# EAGLE design nucleo-block3-b-4 (EAGLE 9.6.2)
AUTHOR: Balazs Racz; DRAWING_TITLE: FREMO 3x Blockplatine; LICENSE: Licensed by the Solderpad Hardware License V2.0; REVIEWER: n/a; REVISION: A1; YEAR: 2024
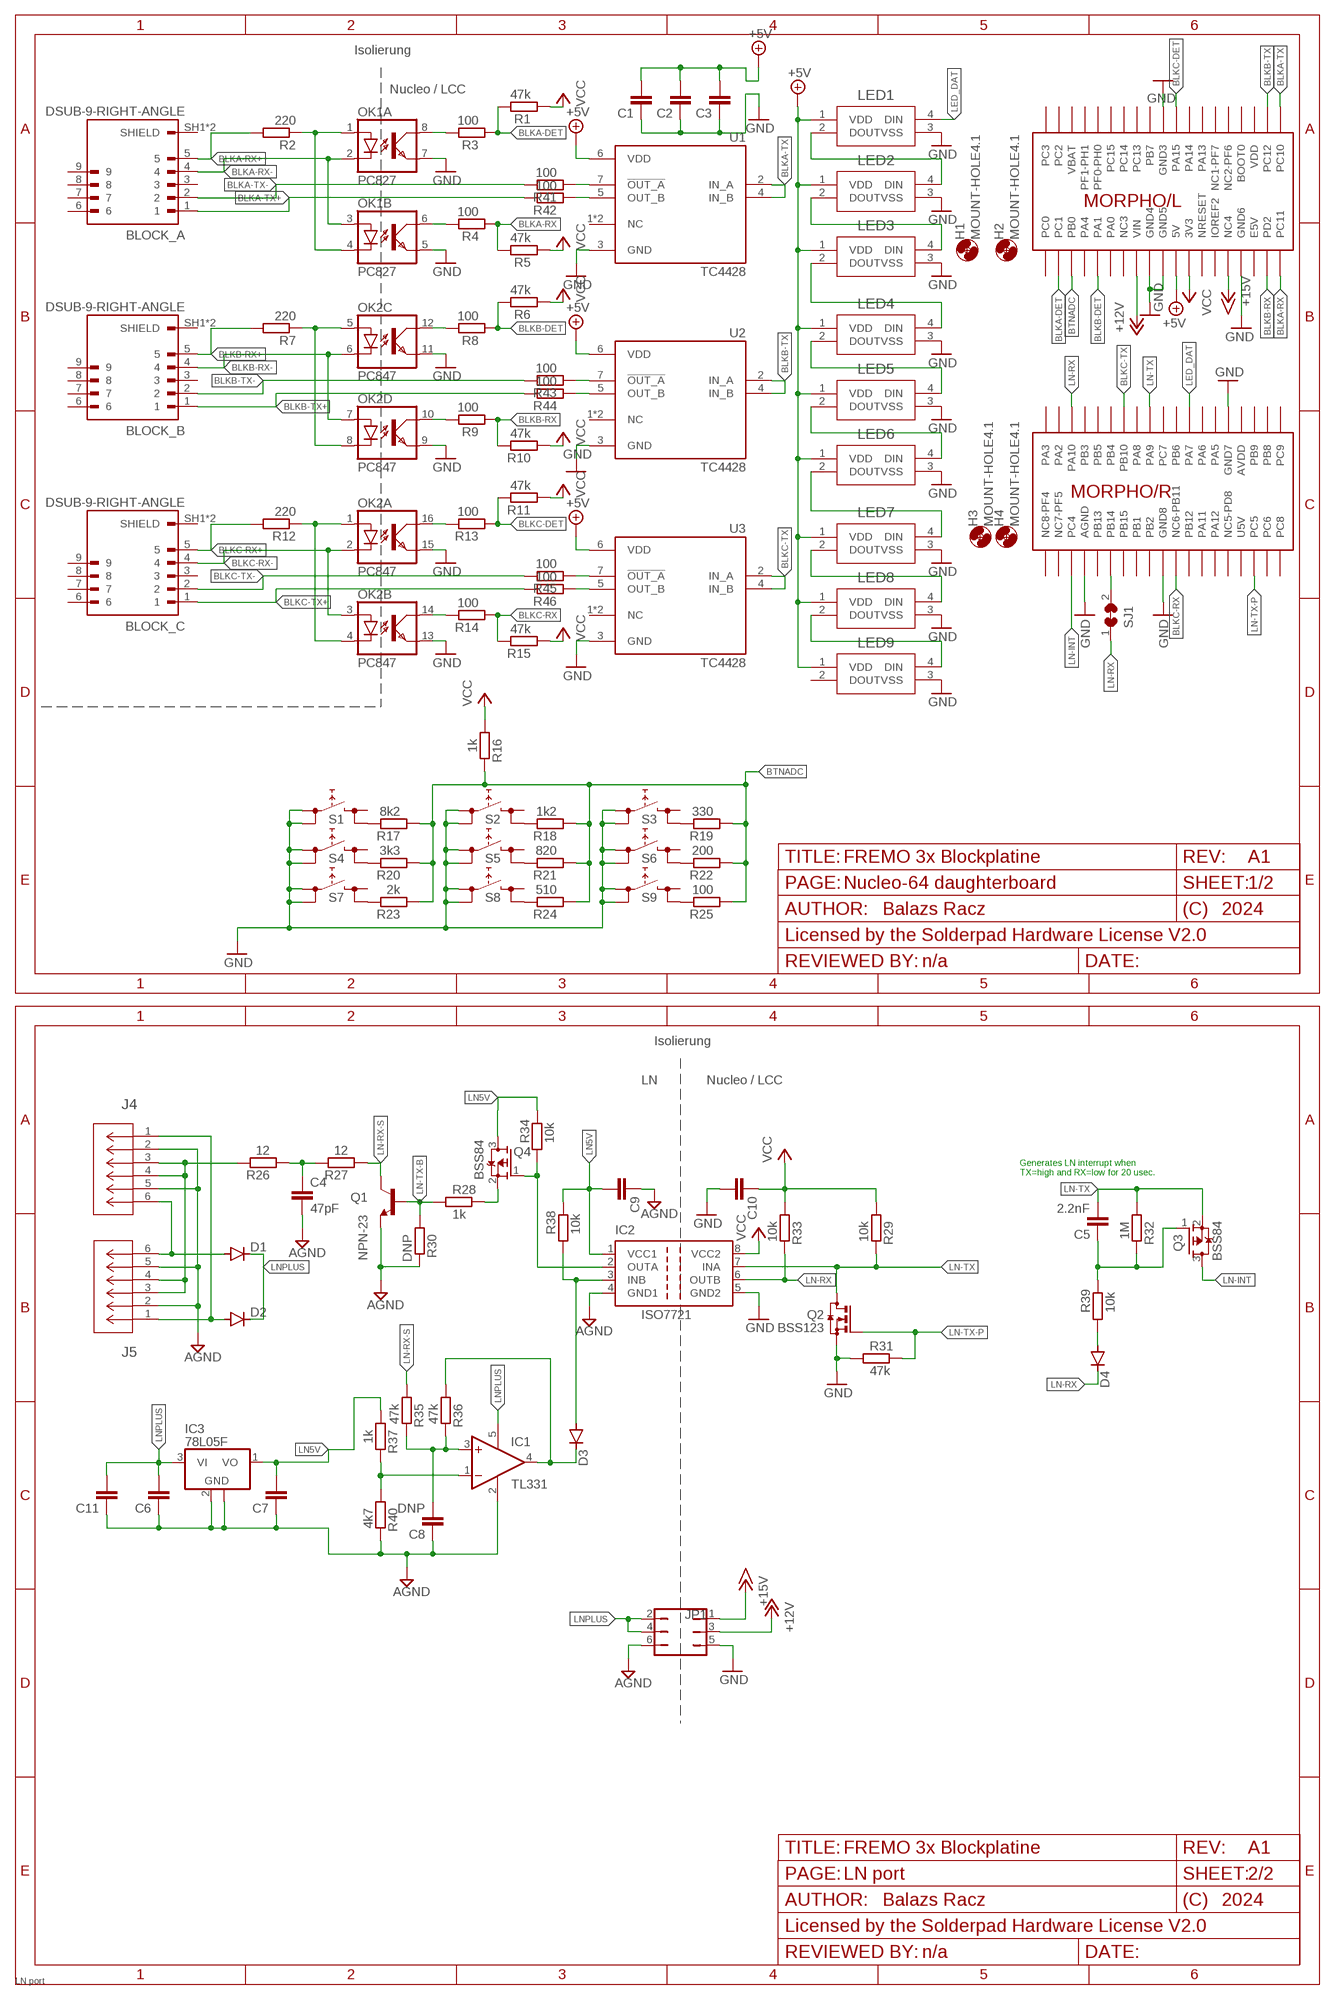
[diagram p0: schematic, sheet 1]
FRAME1 (FRAME_A_L): PAGE: Nucleo-64 daughterboard
FRAME2 (FRAME_A_L): PAGE: Input ports
FRAME3 (FRAME_A_L): PAGE: LN port

## Parts
BLOCK_A  DSUB-9-RIGHT-ANGLE  [ASSMANN_A-DS_09_A_KG-T2S]
BLOCK_B  DSUB-9-RIGHT-ANGLE  [ASSMANN_A-DS_09_A_KG-T2S]
BLOCK_C  DSUB-9-RIGHT-ANGLE  [ASSMANN_A-DS_09_A_KG-T2S]
C1  C-EUC0805  [C0805]
C2  C-EUC0805  [C0805]
C3  C-EUC0805  [C0805]
C4  47pF  C-EUC0805  [C0805]
C5  2.2nF  C-EUC0805  [C0805]
C6  C-EUC0603K  [C0603K]
C7  C-EUC0805  [C0805]
C8  DNP  C-EUC0603K  [C0603K]
C9  C-EUC0603  [C0603]
C10  C-EUC0603  [C0603]
C11  C-EUC0603K  [C0603K]
D1  DIODE-DO214AA  [DO214AA]
D2  DIODE-DO214AA  [DO214AA]
D3  DIODE-MINIMELF  [MINIMELF]
D4  DIODE-MINIMELF  [MINIMELF]
G1  NUCLEO_64_GENERIC  [NUCLEO_BRD_BASE64]
H1  MOUNT-HOLE4.1  [4,1]
H2  MOUNT-HOLE4.1  [4,1]
H3  MOUNT-HOLE4.1  [4,1]
H4  MOUNT-HOLE4.1  [4,1]
IC1  TL331  [DBV-R-PDSO-G5]
IC2  ISO7721  ISO7221A  [SO-08]
IC3  78L05F  [SOT89]
J4  MODJACK6P6C-MJ3245-66-0CONN_MJ3245-66-0_GCT  [CONN_MJ3245-66-0_GCT]
J5  MODJACK6P6C-MJ3245-66-0CONN_MJ3245-66-0_GCT  [CONN_MJ3245-66-0_GCT]
JP1  JP3Q  [JP3Q]
LED1  LED-2812BCOM-16347_SPK-M  [COM-16347_SPK-M]
LED2  LED-2812BCOM-16347_SPK-M  [COM-16347_SPK-M]
LED3  LED-2812BCOM-16347_SPK-M  [COM-16347_SPK-M]
LED4  LED-2812BCOM-16347_SPK-M  [COM-16347_SPK-M]
LED5  LED-2812BCOM-16347_SPK-M  [COM-16347_SPK-M]
LED6  LED-2812BCOM-16347_SPK-M  [COM-16347_SPK-M]
LED7  LED-2812BCOM-16347_SPK-M  [COM-16347_SPK-M]
LED8  LED-2812BCOM-16347_SPK-M  [COM-16347_SPK-M]
LED9  LED-2812BCOM-16347_SPK-M  [COM-16347_SPK-M]
OK1  PC827  [DIL08]
OK2  PC847  [DIL16]
Q1  NPN-23  [SOT23]
Q2  BSS123  [SOT23-NCH]
Q3  BSS84  [SOT23-PCH]
Q4  BSS84  [SOT23-PCH]
R1  47k  R-EU_R0805  [R0805]
R2  220  R-EU_R0805  [R0805]
R3  100  R-EU_R0805  [R0805]
R4  100  R-EU_R0805  [R0805]
R5  47k  R-EU_R0805  [R0805]
R6  47k  R-EU_R0805  [R0805]
R7  220  R-EU_R0805  [R0805]
R8  100  R-EU_R0805  [R0805]
R9  100  R-EU_R0805  [R0805]
R10  47k  R-EU_R0805  [R0805]
R11  47k  R-EU_R0805  [R0805]
R12  220  R-EU_R0805  [R0805]
R13  100  R-EU_R0805  [R0805]
R14  100  R-EU_R0805  [R0805]
R15  47k  R-EU_R0805  [R0805]
R16  1k  R-EU_R0805  [R0805]
R17  8k2  R-EU_R0603  [R0603]
R18  1k2  R-EU_R0603  [R0603]
R19  330  R-EU_R0603  [R0603]
R20  3k3  R-EU_R0603  [R0603]
R21  820  R-EU_R0603  [R0603]
R22  200  R-EU_R0603  [R0603]
R23  2k  R-EU_R0603  [R0603]
R24  510  R-EU_R0603  [R0603]
R25  100  R-EU_R0603  [R0603]
R26  12  R-EU_R0805  [R0805]
R27  12  R-EU_R0805  [R0805]
R28  1k  R-EU_R0805  [R0805]
R29  10k  R-EU_R0805  [R0805]
R30  DNP  R-EU_R0805  [R0805]
R31  47k  R-EU_R0805  [R0805]
R32  1M  R-EU_R0805  [R0805]
R33  10k  R-EU_R0805  [R0805]
R34  10k  R-EU_R0805  [R0805]
R35  47k  R-EU_R0805  [R0805]
R36  47k  R-EU_R0805  [R0805]
R37  1k  R-EU_R0805  [R0805]
R38  10k  R-EU_R0805  [R0805]
R39  10k  R-EU_R0805  [R0805]
R40  4k7  R-EU_R0805  [R0805]
R41  100  R-EU_R0805  [R0805]
R42  100  R-EU_R0805  [R0805]
R43  100  R-EU_R0805  [R0805]
R44  100  R-EU_R0805  [R0805]
R45  100  R-EU_R0805  [R0805]
R46  100  R-EU_R0805  [R0805]
S1  W1  TACTSW-6X6S  [TACTSW-6X6]
S2  W1  TACTSW-6X6S  [TACTSW-6X6]
S3  W1  TACTSW-6X6S  [TACTSW-6X6]
S4  W1  TACTSW-6X6S  [TACTSW-6X6]
S5  W1  TACTSW-6X6S  [TACTSW-6X6]
S6  W1  TACTSW-6X6S  [TACTSW-6X6]
S7  W1  TACTSW-6X6S  [TACTSW-6X6]
S8  W1  TACTSW-6X6S  [TACTSW-6X6]
S9  W1  TACTSW-6X6S  [TACTSW-6X6]
SJ1  SJ-C  [SJW-C]
U1  TC4428  TC4428ACOA  [SOIC127P600X175-8N]
U2  TC4428  TC4428ACOA  [SOIC127P600X175-8N]
U3  TC4428  TC4428ACOA  [SOIC127P600X175-8N]

## Nets
+5V: C1.2 C2.2 C3.2 G1.5V2(5V) LED1.1(VDD) LED2.1(VDD) LED3.1(VDD) LED4.1(VDD) LED5.1(VDD) LED6.1(VDD) LED7.1(VDD) LED8.1(VDD) LED9.1(VDD) U1.6(VDD) U2.6(VDD) U3.6(VDD)
+12V: G1.VIN2(VIN) JP1.3
+15V: G1.NC4 JP1.1
AGND: C4.2 C6.1 C7.1 C8.1 C9.1 C11.1 IC1.2(GND) IC2.4(GND1) IC3.2(GND) IC3.2@1(GND) J4.2 J4.5 J5.2 J5.5 JP1.6 Q1.2(E) R30.2 R40.2
BLKA-DET: G1.PC1 R1.2 R3.1
BLKA-RX: G1.PC11 R4.1 R5.2
BLKA-RX+: BLOCK_A.5 R2.2
BLKA-RX-: BLOCK_A.4 OK1.2(A:C) OK1.3(B:A)
BLKA-TX: G1.PC10 U1.2(IN_A) U1.4(IN_B)
BLKA-TX+: BLOCK_A.1 R42.2
BLKA-TX-: BLOCK_A.2 R41.2
BLKB-DET: G1.PA1 R6.2 R8.1
BLKB-RX: G1.PD2 R9.1 R10.2
BLKB-RX+: BLOCK_B.5 R7.2
BLKB-RX-: BLOCK_B.4 OK2.6(C:C) OK2.7(D:A)
BLKB-TX: G1.PC12 U2.2(IN_A) U2.4(IN_B)
BLKB-TX+: BLOCK_B.1 R44.2
BLKB-TX-: BLOCK_B.2 R43.2
BLKC-DET: G1.PA15 R11.2 R13.1
BLKC-RX: G1.NC6-PB11 R14.1 R15.2
BLKC-RX+: BLOCK_C.5 R12.2
BLKC-RX-: BLOCK_C.4 OK2.2(A:C) OK2.3(B:A)
BLKC-TX: G1.PB10 U3.2(IN_A) U3.4(IN_B)
BLKC-TX+: BLOCK_C.1 R46.2
BLKC-TX-: BLOCK_C.2 R45.2
BTNADC: G1.PB0 R16.2 R17.1 R18.1 R19.1 R20.1 R21.1 R22.1 R23.1 R24.1 R25.1
GND: C1.1 C2.1 C3.1 C10.2 G1.AGND G1.GND3 G1.GND4 G1.GND5 G1.GND6 G1.GND7 G1.GND8 IC2.5(GND2) JP1.5 LED1.3(VSS) LED2.3(VSS) LED3.3(VSS) LED4.3(VSS) LED5.3(VSS) LED6.3(VSS) LED7.3(VSS) LED8.3(VSS) LED9.3(VSS) OK1.5(B:EMIT) OK1.7(A:EMIT) OK2.9(D:EMIT) OK2.11(C:EMIT) OK2.13(B:EMIT) OK2.15(A:EMIT) Q2.2(S) R31.1 S1.1(1.1) S1.2(1.2) S2.1(1.1) S2.2(1.2) S3.1(1.1) S3.2(1.2) S4.1(1.1) S4.2(1.2) S5.1(1.1) S5.2(1.2) S6.1(1.1) S6.2(1.2) S7.1(1.1) S7.2(1.2) S8.1(1.1) S8.2(1.2) S9.1(1.1) S9.2(1.2) U1.3(GND) U2.3(GND) U3.3(GND)
LED_DAT: G1.PA7 LED1.4(DIN)
LN5V: C7.2 C9.2 IC2.1(VCC1) IC3.1(VO) Q4.3(D) R34.2 R37.1 R38.2
LN-INT: G1.PC4 Q3.3(D)
LN-RX: D4.C G1.PA10 IC2.6(OUTB) R33.2 SJ1.1
LN-RX-ALT: G1.PB14 SJ1.2
LN-RX-S: Q1.3(C) R27.1 R35.1
LN-TX: C5.2 G1.PA9 IC2.7(INA) Q2.3(D) Q3.2(S) R29.2 R32.1
LN-TX-B: Q1.1(B) R28.1 R30.1
LN-TX-P: G1.PC5 Q2.1(G) R31.2
LNPLUS: C6.2 C11.2 D1.C D2.C IC1.5(V+) IC3.3(VI) JP1.2 JP1.4
N$1: OK2.1(A:A) OK2.4(B:C) R12.1
N$2: OK2.16(A:COL) R13.2
N$3: OK2.14(B:COL) R14.2
N$4: D1.A J4.6 J5.6
N$5: C4.1 R26.1 R27.2
N$6: D2.A J4.1 J5.1
N$7: J4.3 J4.4 J5.3 J5.4 R26.2
N$8: IC2.2(OUTA) Q4.1(G) R34.1
N$9: R17.2 S1.4(2.2)
N$10: D4.A R39.1
N$11: Q4.2(S) R28.2
N$12: LED1.2(DOUT) LED2.4(DIN)
N$13: LED2.2(DOUT) LED3.4(DIN)
N$14: LED3.2(DOUT) LED4.4(DIN)
N$15: LED4.2(DOUT) LED5.4(DIN)
N$16: LED5.2(DOUT) LED6.4(DIN)
N$17: LED6.2(DOUT) LED7.4(DIN)
N$18: LED7.2(DOUT) LED8.4(DIN)
N$19: LED8.2(DOUT) LED9.4(DIN)
N$20: D3.A IC2.3(INB) R38.1
N$21: R20.2 S4.4(2.2)
N$22: C5.1 Q3.1(G) R32.2 R39.2
N$23: R23.2 S7.4(2.2)
N$24: R41.1 U1.7(!OUT_A)
N$25: R42.1 U1.5(OUT_B)
N$26: R18.2 S2.4(2.2)
N$27: R21.2 S5.4(2.2)
N$28: R24.2 S8.4(2.2)
N$29: IC1.1(-IN) R37.2 R40.1
N$30: C8.2 IC1.3(+IN) R35.2 R36.2
N$31: OK1.1(A:A) OK1.4(B:C) R2.1
N$32: R19.2 S3.4(2.2)
N$33: R22.2 S6.4(2.2)
N$34: R25.2 S9.4(2.2)
N$35: OK2.5(C:A) OK2.8(D:C) R7.1
N$36: D3.C IC1.4(OUT) R36.1
N$37: R43.1 U2.7(!OUT_A)
N$38: R44.1 U2.5(OUT_B)
N$39: R45.1 U3.7(!OUT_A)
N$40: R46.1 U3.5(OUT_B)
N$41: OK1.8(A:COL) R3.2
N$42: OK1.6(B:COL) R4.2
N$43: OK2.12(C:COL) R8.2
N$44: OK2.10(D:COL) R9.2
VCC: C10.1 G1.3V3 IC2.8(VCC2) R1.1 R5.1 R6.1 R10.1 R11.1 R15.1 R16.1 R29.1 R33.1
Unconnected: BLOCK_A.3 BLOCK_A.6 BLOCK_A.7 BLOCK_A.8 BLOCK_A.9 BLOCK_A.SH1(SHIELD) BLOCK_A.SH2(SHIELD) BLOCK_B.3 BLOCK_B.6 BLOCK_B.7 BLOCK_B.8 BLOCK_B.9 BLOCK_B.SH1(SHIELD) BLOCK_B.SH2(SHIELD) BLOCK_C.3 BLOCK_C.6 BLOCK_C.7 BLOCK_C.8 BLOCK_C.9 BLOCK_C.SH1(SHIELD) BLOCK_C.SH2(SHIELD) G1.BOOT0 G1.IOREF2 G1.NC1-PF7 G1.NC2-PF6 G1.NC3 G1.NC5-PD8 G1.NC7-PF5 G1.NC8-PF4 G1.NRESET G1.PA0 G1.PA2 G1.PA3 G1.PA4 G1.PA5 G1.PA6 G1.PA8 G1.PA11 G1.PA12 G1.PA13 G1.PA14 G1.PB1 G1.PB2 G1.PB3 G1.PB4 G1.PB5 G1.PB6 G1.PB7 G1.PB8 G1.PB9 G1.PB12 G1.PB13 G1.PB15 G1.PC0 G1.PC2 G1.PC3 G1.PC6 G1.PC7 G1.PC8 G1.PC9 G1.PC13 G1.PC14 G1.PC15 G1.PF0-PH0 G1.PF1-PH1 LED9.2(DOUT) S1.3(2.1) S2.3(2.1) S3.3(2.1) S4.3(2.1) S5.3(2.1) S6.3(2.1) S7.3(2.1) S8.3(2.1) S9.3(2.1) U1.1(NC) U1.8(NC) U2.1(NC) U2.8(NC) U3.1(NC) U3.8(NC)

## Notes on the sheet
- Isolierung
- Nucleo / LCC
- Isolierung
- LN | Nucleo / LCC
- Generates LN interrupt when
  TX=high and RX=low for 20 usec.

## Power pins joined to a net without a drawn wire
AVDD: G1.AVDD
E5V: G1.E5V
U5V: G1.U5V
VBAT: G1.VBAT
VDD: G1.VDD

## Library data of the parts
BLOCK_A BLOCK_B BLOCK_C = eagleparts:DSUB-9-RIGHT-ANGLE: A-DS_09_A_KG-T2S Female: digikey AE10921-ND Male: digikey AE10968-ND; MANUFACTURER: Assmann WSW Components; MAXIMUM_PACKAGE_HEIGHT: 12.8mm; PARTREV: 10; STANDARD: Manufacturer recommendations
C1-C11 = rcl:C-EU: CAPACITOR, European symbol; SPICEPREFIX: C
D1-D4 = diode:DIODE-: DIODE
G1 = eagleparts:NUCLEO_64_GENERIC
H1-H4 = holes:MOUNT-HOLE: MOUNTING HOLE with drill center marker
IC1 = linear:TL331: SINGLE DIFFERENTIAL COMPARATOR Source: Data sheet <http://www.ti.com/lit/ds/symlink/tl331-q1.pdf>
IC2 = texas:ISO7221: DUAL DIGITAL ISOLATORS Source: http://focus.ti.com/lit/ds/symlink/iso7221a.pdf; MPN: ISO7221AD; OC_FARNELL: 1390651; OC_NEWARK: 48M0672
IC3 = linear:78L*: POSITOIV-VOLTAGE REGULATORS Output up to 100 mA Source: Datasheet <http://focus.ti.com/lit/ds/symlink/ua78l05.pdf>
J4 J5 = eagleparts:MODJACK6P6C-MJ3245-66-0: 6p6c modular jack digikey: 2073-MJ3245-66-0-ND; COPYRIGHT: Copyright (C) 2024 Ultra Librarian. All rights reserved.; MANUFACTURER_PART_NUMBER: MJ3245-66-0; MFR_NAME: Global Connector Technology; TYPE: Modular Connector Jacks
JP1 = jumper:JP3Q: JUMPER
LED1-LED9 = eagleparts:LED-2812B; COPYRIGHT: Copyright (C) 2024 Ultra Librarian. All rights reserved.; MANUFACTURER_PART_NUMBER: COM-16347; MFR_NAME: Sparkfun; TYPE: LED Addressable
OK1 = optocoupler:PC827: SHARP OPTO COUPLER; OC_FARNELL: unknown; OC_NEWARK: unknown
OK2 = optocoupler:PC847: SHARP OPTO COUPLER; OC_FARNELL: 9707735; OC_NEWARK: unknown
Q1 = eagleparts:NPN-23
Q2 = eagleparts:BSS123: N-CHANNEL MOS FET
Q3 Q4 = eagleparts:BSS84: P-CHANNEL MOS FET
R1-R46 = rcl:R-EU_: RESISTOR, European symbol; SPICEPREFIX: R
S1-S9 = g-e2e-training:TACTSW-6X6: 6.2 X 6.5mm TACT Switch (SMD) Source: http://www3.alps.co.jp/WebObjects/catalog.woa/PDF/E/Switch/Tact/SKHM/SKHM.PDF
SJ1 = eagleparts:SJ-C
U1-U3 = eagleparts:TC4428ACOA: Low-Side Gate Driver IC Inverting, Non-Inverting 8-SOIC; MANUFACTURER: Microchip; MAXIMUM_PACKAGE_HEIGHT: 1.75 mm; PARTREV: J; STANDARD: IPC 7351B

## Net classes
0 default: width 0.254 mm, clearance 0.254 mm

## Board
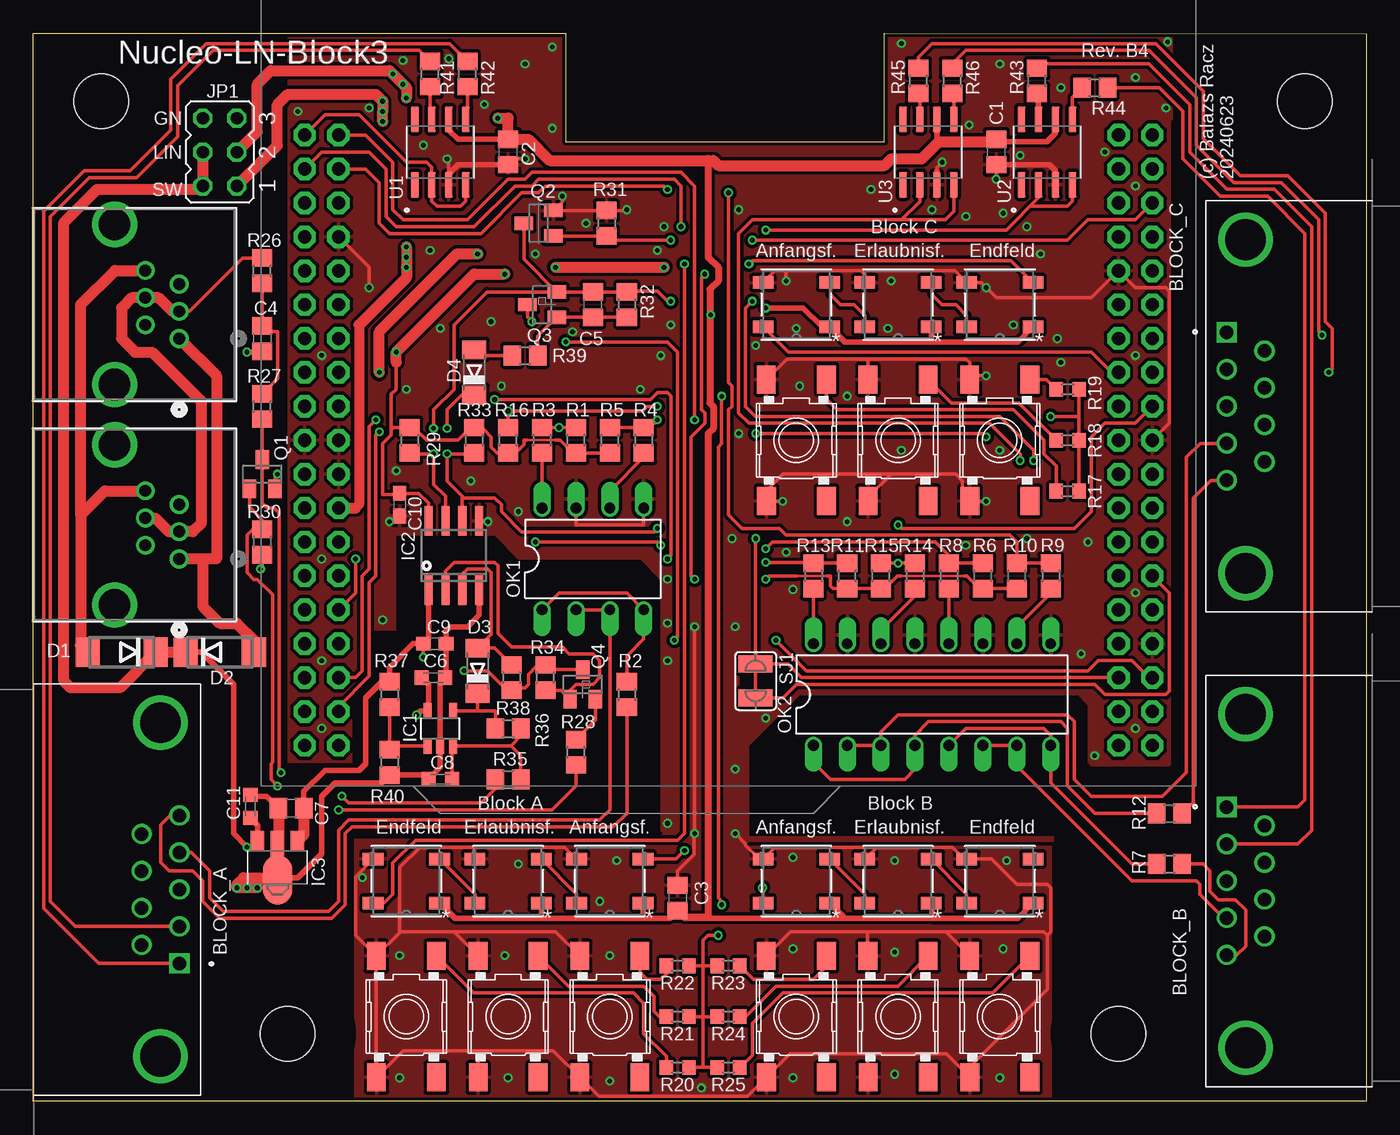
[diagram p1: board, top side]
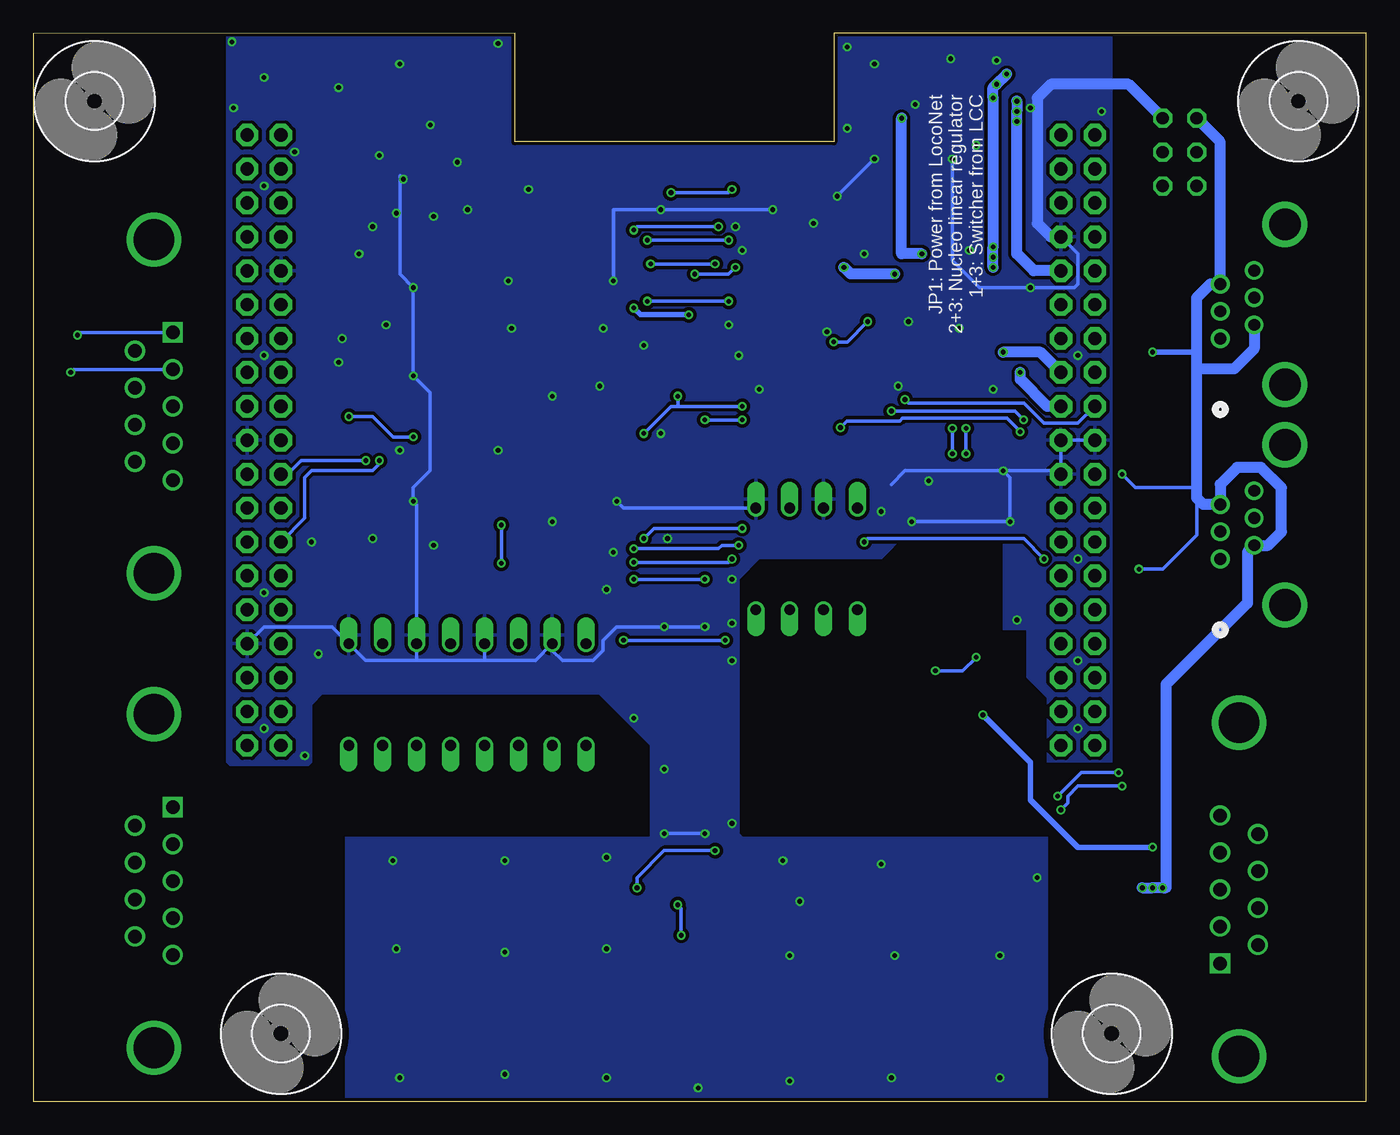
[diagram p2: board, bottom side, seen from below]

Size 99.83 x 80.01 mm. Coordinates in mm from the lower left corner, seen from the top.
Outline: 99.83,0 0,0 0,80.01 39.88,80.01 39.88,71.88 63.75,71.88 63.75,80.01 99.83,80 99.83,0
Copper layers (1*16): Top 0.035mm / dielectric 1.5mm / Bottom 0.035mm
Design rules "SeeedStudio_2layer_DRU_no_angle_20140221": minimum track width 6mil, minimum drill 12mil, track to track 6mil, track to pad 6mil, pad to pad 6mil, via to via 6mil, smd to smd 0mil, copper to edge 10mil, drill to drill 10mil, minimum pad ring 10mil, minimum via ring 6mil, stop-mask expansion 2mil, vias tented up to drill 100mil, thermal gap 10mil
tRestrict: 12 lines

### Footprints (pad centres in the part's own frame; a part is rotated, then mirrored left to right if it is on the bottom)
ASSMANN_A-DS_09_A_KG-T2S = drill 1 square: 1 5.54,1.42 | drill 1: 2 2.77,1.42; 3 0,1.42; 4 -2.77,1.42; 5 -5.54,1.42; 6 4.155,-1.42; 7 1.385,-1.42; 8 -1.385,-1.42; 9 -4.155,-1.42 | drill 3.05: SH1 -12.495,0; SH2 12.495,0
C0805 = smd 1.3 x 1.5: 1 -0.95,0; 2 0.95,0
C0603K = smd 1.05 x 1.08: 1 -0.875,0; 2 0.875,0
C0603 = smd 1.1 x 1: 1 -0.85,0; 2 0.85,0
DO214AA = smd 1.8 x 2.2: A 2.55,0; C -2.55,0
MINIMELF = smd 1.4 x 1.8: A 1.7,0; C -1.7,0
NUCLEO_BRD_BASE64 = drill 1 pad 1.676 octagon: 3V3 2.54,27.94; 5V2 2.54,25.4; AGND 63.5,7.62; AVDD 60.96,38.1; BOOT0 0,38.1; E5V 2.54,40.64; GND3 0,22.86; GND4 2.54,20.32; GND5 2.54,22.86; GND6 2.54,38.1; GND7 60.96,35.56; GND8 63.5,22.86; IOREF2 2.54,33.02; NC1-PF7 0,33.02; NC2-PF6 0,35.56; NC3 2.54,15.24; NC4 2.54,35.56; NC5-PD8 63.5,35.56; NC6-PB11 63.5,25.4; NC7-PF5 63.5,2.54; NC8-PF4 63.5,0; NRESET 2.54,30.48; PA0 2.54,12.7; PA1 2.54,10.16; PA2 60.96,2.54; PA3 60.96,0; PA4 2.54,7.62; PA5 60.96,33.02; PA6 60.96,30.48; PA7 60.96,27.94; PA8 60.96,17.78; PA9 60.96,20.32; PA10 60.96,5.08; PA11 63.5,30.48; PA12 63.5,33.02; PA13 0,30.48; PA14 0,27.94; PA15 0,25.4; PB0 2.54,5.08; PB1 63.5,17.78; PB2 63.5,20.32; PB3 60.96,7.62; PB4 60.96,12.7; PB5 60.96,10.16; PB6 60.96,25.4; PB7 0,20.32; PB8 60.96,43.18; PB9 60.96,40.64; PB10 60.96,15.24; PB12 63.5,27.94; PB13 63.5,10.16; PB14 63.5,12.7; PB15 63.5,15.24; PC0 2.54,0; PC1 2.54,2.54; PC2 0,2.54; PC3 0,0; PC4 63.5,5.08; PC5 63.5,40.64; PC6 63.5,43.18; PC7 60.96,22.86; PC8 63.5,45.72; PC9 60.96,45.72; PC10 0,45.72; PC11 2.54,45.72; PC12 0,43.18; PC13 0,17.78; PC14 0,15.24; PC15 0,12.7; PD2 2.54,43.18; PF0-PH0 0,10.16; PF1-PH1 0,7.62; U5V 63.5,38.1; VBAT 0,5.08; VDD 0,40.64; VIN2 2.54,17.78
4,1 = hole 4.1: 0,0
DBV-R-PDSO-G5 = smd 0.6 x 1.2: 1 -0.95,-1.306; 2 0,-1.306; 3 0.95,-1.306; 4 0.95,1.306; 5 -0.95,1.306
SO-08 = smd 0.6 x 2.2: 1 -1.905,-2.6; 2 -0.635,-2.6; 3 0.635,-2.6; 4 1.905,-2.6; 5 1.905,2.6; 6 0.635,2.6; 7 -0.635,2.6; 8 -1.905,2.6
SOT89 = smd 1 x 1.5: 1 -1.499,-1.981; 3 1.499,-1.981 | smd 1 x 2: 2 0,-1.727 | smd 2.2 x 3.7: 2@1 0,0.94
CONN_MJ3245-66-0_GCT = drill 0.889 pad 1.397: 1 0,0; 2 -1.02,-2.54; 3 -2.04,0; 4 -3.06,-2.54; 5 -4.08,0; 6 -5.1,-2.54 | drill 2.362 pad 2.362: 7 -8.55,-4.84; 8 3.45,-4.84
JP3Q = drill 0.914 octagon: 1 -2.54,-1.27; 2 -2.54,1.27; 3 0,-1.27; 4 0,1.27; 5 2.54,-1.27; 6 2.54,1.27
COM-16347_SPK-M = smd 1.549 x 0.94: 1 -2.489,1.65; 2 -2.489,-1.65; 3 2.489,-1.65; 4 2.489,1.65
DIL08 = drill 0.813 offset: 1 -3.81,-3.81; 2 -1.27,-3.81; 3 1.27,-3.81; 4 3.81,-3.81; 5 3.81,3.81; 6 1.27,3.81; 7 -1.27,3.81; 8 -3.81,3.81
DIL16 = drill 0.813 offset: 1 -8.89,-3.81; 2 -6.35,-3.81; 3 -3.81,-3.81; 4 -1.27,-3.81; 5 1.27,-3.81; 6 3.81,-3.81; 7 6.35,-3.81; 8 8.89,-3.81; 9 8.89,3.81; 10 6.35,3.81; 11 3.81,3.81; 12 1.27,3.81; 13 -1.27,3.81; 14 -3.81,3.81; 15 -6.35,3.81; 16 -8.89,3.81
SOT23 = smd 1 x 1.4: 1 -0.95,-1.1; 2 0.95,-1.1; 3 0,1.1
SOT23-NCH = smd 1 x 1.4: 1 -0.95,-1.1; 2 0.95,-1.1; 3 0,1.1
SOT23-PCH = smd 1 x 1.4: 1 -0.95,-1.1; 2 0.95,-1.1; 3 0,1.1
R0805 = smd 1.3 x 1.5: 1 -0.95,0; 2 0.95,0
R0603 = smd 1 x 1.1: 1 -0.85,0; 2 0.85,0
TACTSW-6X6 = smd 2.1 x 1.4: 1 -4.55,2.24; 2 4.55,2.25; 3 -4.55,-2.25; 4 4.55,-2.25
SJW-C = smd 1.27 x 2.54: 1 -1.27,0; 2 1.27,0
SOIC127P600X175-8N = smd 1.9 x 0.6: 1 -2.455,1.905; 2 -2.455,0.635; 3 -2.455,-0.635; 4 -2.455,-1.905; 5 2.455,-1.905; 6 2.455,-0.635; 7 2.455,0.635; 8 2.455,1.905

### Placement (x,y rotation side)
BLOCK_A  9.53,15.88 270 top
BLOCK_B  90.81,16.51 90 top
BLOCK_C  90.81,52.07 90 top
C1  72.12,71.12 90 top
C2  35.56,71.12 90 top
C3  48.26,15.24 270 top
C4  17.14,57.15 270 top
C5  41.91,59.69 90 top
C6  29.97,31.75 180 top
C7  19.3,21.97 0 top
C8  30.48,24.13 0 top
C9  30.06,34.29 180 top
C10  27.43,44.7 270 top
C11  16.26,22.1 270 top
D1  6.6,33.66 180 top
D2  13.97,33.66 0 top
D3  33.27,32.26 90 top
D4  33.02,54.61 90 top
G1  20.32,26.67 0 top
H1  5.08,74.93 0 bottom
H2  19.05,5.08 0 bottom
H3  81.28,5.08 0 bottom
H4  95.25,74.93 0 bottom
IC1  30.48,27.94 0 top
IC2  31.5,40.89 0 top
IC3  18.29,17.53 180 top
J4  10.92,40.64 270 top
J5  10.92,57.15 270 top
JP1  13.97,71.12 90 top
LED1  57.15,59.69 180 top
LED2  64.77,59.69 180 top
LED3  72.39,59.69 180 top
LED4  27.94,16.51 180 top
LED5  35.56,16.51 180 top
LED6  43.18,16.51 180 top
LED7  57.15,16.51 180 top
LED8  64.77,16.51 180 top
LED9  72.39,16.51 180 top
OK1  41.91,40.64 0 top
OK2  67.31,30.48 0 top
Q1  17.14,46.99 0 top
Q2  37.85,65.79 90 top
Q3  38.1,59.69 90 top
Q4  41.15,31.24 0 top
R1  40.64,49.53 90 top
R2  44.45,30.48 270 top
R3  38.1,49.53 270 top
R4  45.72,49.53 270 top
R5  43.18,49.53 90 top
R6  71.12,39.37 90 top
R7  85.09,17.78 0 top
R8  68.58,39.37 270 top
R9  76.2,39.37 270 top
R10  73.66,39.37 90 top
R11  60.96,39.37 90 top
R12  85.09,21.59 0 top
R13  58.42,39.37 270 top
R14  66.04,39.37 270 top
R15  63.5,39.37 90 top
R16  35.56,49.53 90 top
R17  77.47,45.72 180 top
R18  77.47,49.53 180 top
R19  77.47,53.34 180 top
R20  48.26,2.54 180 top
R21  48.26,6.35 180 top
R22  48.26,10.16 180 top
R23  52.07,10.16 0 top
R24  52.07,6.35 0 top
R25  52.07,2.54 0 top
R26  17.14,62.23 90 top
R27  17.14,52.07 90 top
R28  40.64,26.16 90 top
R29  28.19,49.53 270 top
R30  17.14,41.91 270 top
R31  42.93,65.79 270 top
R32  44.45,59.69 270 top
R33  33.02,49.53 270 top
R34  38.35,31.75 90 top
R35  35.56,24.13 0 top
R36  35.56,27.94 0 top
R37  26.67,30.48 270 top
R38  35.81,31.75 270 top
R39  36.83,55.88 0 top
R40  26.67,25.4 270 top
R41  29.72,76.96 90 top
R42  32.51,76.96 90 top
R43  75.18,76.45 90 top
R44  79.5,75.95 0 top
R45  66.29,76.45 90 top
R46  68.83,76.45 90 top
S1  57.15,49.53 90 top
S2  64.77,49.53 90 top
S3  72.39,49.53 90 top
S4  27.94,6.35 90 top
S5  35.56,6.35 90 top
S6  43.18,6.35 90 top
S7  57.15,6.35 90 top
S8  64.77,6.35 90 top
S9  72.39,6.35 90 top
SJ1  54.1,31.5 270 top
U1  30.48,71.12 90 top
U2  75.93,71.12 90 top
U3  67.04,71.12 90 top

### Tracks (layer width: path | path; a pad name or v marks a point on that pad's centre or on a via)
+5V  (via drill 0.35)
  Top 0.406: LED3.1 73.73,56.9 67.31,56.9 | 67.31,56.9 60.78,56.9 LED1.1 59.05,58.04 57.66,59.44 v54.86,59.44 | LED2.1 67.26,56.95 67.31,56.9 | LED4.1 31.57,13.72 38.1,13.72 | 38.1,13.72 45.72,13.72 | 45.72,13.72 47.69,13.72 C3.2 48.83,13.72 60.78,13.72 | LED6.1 45.67,13.77 45.72,13.72 | LED5.1 38.05,13.77 38.1,13.72 | LED7.1 60.78,13.72 | LED9.1 73.73,13.72 67.31,13.72 | 67.31,13.72 60.78,13.72 | LED8.1 67.31,14.81 67.31,13.72 | U2.6 76.56,72.52 75.93,71.88 72.31,71.88 | C2.2 31.82,72.07 31.11,72.77 U1.6 | v50.75,58.93 50.67,58.93 | U3.6 67.67,72.03 67.82,71.88
  Top 0.508: 50.55,70.48 50.55,63.25 51.31,62.48 51.31,61.47 50.67,60.83 50.67,58.93 50.67,52.32 50.93,52.07 50.93,50.42 50.55,50.04 50.55,13.78 48.77,13.78 C3.2
  Top 0.813: v25.91,54.61 25.91,57.66 31.75,63.5 v33.27,63.5 | v34.8,73.66 35.56,73.66 C2.2 37.08,72.07 38.67,70.48 50.55,70.48 50.93,70.48 51.31,70.1 63.75,70.1 64.26,70.61 66.55,70.61 67.82,71.88 71.93,71.88 | 71.93,71.88 72.31,71.88 C1.2 71.93,71.88
  Bottom 0.406: v54.86,59.44 54.36,58.93 v50.75,58.93
  Bottom 0.813: G1.5V2 23.88,52.07 25.91,54.1 v25.91,54.61 | v33.27,63.5 34.8,63.5 v34.8,73.66
+12V  (via drill 0.35)
  Top 0.254: v27.94,63.25 v27.94,62.48
  Top 0.762: 24.13,44.45 24.38,44.7 24.38,58.17
  Top 0.813: G1.VIN2 24.13,44.45 | JP1.3 16.76,72.64 16.76,76.2 17.78,77.22 26.67,77.22 27.94,75.95 v27.94,75.18 | 24.38,58.17 27.94,61.72 v27.94,62.48 v27.94,64.01
  Bottom 0.813: v26.92,76.96 v27.69,76.2 27.94,75.95 v27.94,75.18 v27.94,64.01 v27.94,62.48
+15V  (via drill 0.35)
  Top 0.813: JP1.1 18.26,71.6 18.26,74.65 19.05,75.44 25.65,75.44 v26.16,74.93 v26.16,74.17 v26.16,73.41
  Bottom 0.813: G1.NC4 24.89,62.23 26.16,63.5 v26.16,74.17 v26.16,74.93
AGND  (via drill 0.35)
  Top 0.254: R30.2 17.14,40.01 v17.02,39.88 | Q1.2 18.09,46.8 v18.29,46.99
  Top 0.406: C4.2 17.08,56.13 v16,56.13 | IC2.4 33.4,36.45 32.51,35.56 31.24,35.56 30.91,35.23 C9.1 30.91,31.81 C6.1 30.48,31.38 IC1.2 30.48,25 C8.1 29.29,24.45 R40.2 26.1,23.88 22.61,23.88 21.59,22.86 21.59,18.54 19.81,16.76 18.11,16.76 | IC3.2@1 IC3.2 | C11.1 16.37,22.86 17.46,22.86 C7.1
  Top 0.813: v16.76,16 v15.24,16 15.24,16.26 15.75,16.76 18.11,16.76 IC3.2@1 | C7.1 18.35,19.32 IC3.2
  Bottom 0.254: v17.02,39.88 15.24,39.88 12.7,42.42 12.7,45.21 | v18.29,46.99 17.27,45.97 12.7,45.97
  Bottom 0.406: v16,56.13 12.7,56.13
  Bottom 0.813: 12.7,54.86 12.7,45.97 12.7,45.21 12.21,44.72 J4.5 10.92,46.23 9.65,47.5 7.87,47.5 6.35,45.97 6.35,42.67 7.36,41.66 J4.2 8.89,41.15 8.89,37.34 14.99,31.24 14.99,16 v15.24,16 v16,16 v16.76,16 | 12.7,54.86 12.7,56.13 12.7,60.2 11.67,61.23 J5.5 10.92,71.88 JP1.6 | J5.2 8.38,56.39 9.91,54.86 12.7,54.86
BLKA-DET  (via drill 0.35)
  Top 0.254: R3.1 v39.37,50.48 R1.2 | G1.PC1 22.86,29.57 25.15,31.86 25.15,38.86 25.65,39.37 25.65,49.91 v25.91,50.16
  Bottom 0.254: v25.91,50.16 26.92,51.18 34.72,51.18 34.93,50.98 38.87,50.98 v39.37,50.48
BLKA-RX  (via drill 0.35)
  Top 0.254: R5.2 R4.1 46.16,50.48 v46.74,51.05 | G1.PC11 24.89,72.39 26.92,70.36 26.92,66.8 27.69,66.04 32.51,66.04 35.56,69.09 36.83,69.09 37.34,69.6 48.51,69.6 49.53,68.58 v49.53,51.05
  Bottom 0.254: v49.53,51.05 v46.74,51.05
BLKA-RX+
  Top 0.254: R2.2 44.45,21.59 43.43,20.57 23.88,20.57 23.37,20.07 23.37,14.73 22.35,13.72 15.49,13.72 13.97,13.72 12.7,14.99 12.7,16.51 12.45,16.76 12.19,17.02 11.94,17.27 10.16,17.27 9.53,17.91 9.53,20.7 10.24,21.41 BLOCK_A.5
BLKA-RX-
  Top 0.254: OK1.2 OK1.3 43.18,21.84 42.42,21.08 23.62,21.08 22.86,20.32 22.86,14.99 22.1,14.22 14.22,14.22 13.21,15.24 13.21,17.27 11.84,18.64 BLOCK_A.4
BLKA-TX
  Top 0.254: G1.PC10 21.84,73.91 24.38,73.91 27.94,70.36 29.46,70.36 29.84,69.98 U1.2 29.84,67.44 30.23,67.06 32,67.06 32.38,67.44 U1.4
BLKA-TX+
  Top 0.254: BLOCK_A.1 4.91,10.34 0.76,14.48 0.76,66.67 3.81,69.72 7.24,69.72 10.29,72.77 10.29,76.58 12.95,79.25 31.18,79.25 R42.2
BLKA-TX-
  Top 0.254: BLOCK_A.2 3.15,13.11 1.27,14.99 1.27,66.29 4.19,69.22 7.75,69.22 10.79,72.26 10.79,76.07 13.46,78.74 28.89,78.74 R41.2
BLKB-DET  (via drill 0.35)
  Top 0.254: R6.2 R8.1 68.58,40.89 67.56,41.91 55.37,41.91 v54.86,41.4 | G1.PA1 24.13,38.1 v24.13,40.64 | v37.59,41.91 46.74,41.91 v46.99,41.66
  Bottom 0.254: v24.13,40.64 25.65,42.16 37.34,42.16 v37.59,41.91 | v54.86,41.4 48.51,41.4 48.26,41.66 v46.99,41.66
BLKB-RX  (via drill 0.35)
  Top 0.254: G1.PD2 24.89,69.85 25.91,68.83 25.91,65.79 26.67,65.02 33.53,65.02 36.58,68.07 37.85,68.07 38.35,68.58 47.24,68.58 v47.5,68.33 | v52.07,68.07 52.07,53.85 52.32,53.59 52.32,52.07 52.07,51.82 52.07,43.94 53.09,42.93 55.88,42.93 56.39,42.42 73.15,42.42 73.66,41.91 R10.2 R9.1
  Bottom 0.254: v47.5,68.33 47.75,68.07 v52.07,68.07
BLKB-RX+
  Top 0.254: R7.2 87.63,17.78 88.14,17.27 88.14,15.75 88.77,15.11 90.04,15.11 90.81,14.35 90.81,11.63 90.15,10.97 BLOCK_B.5
BLKB-RX-
  Top 0.254: OK2.6 OK2.7 73.66,25.15 82.3,16.51 87.12,16.51 87.38,16.26 87.38,15.49 89.13,13.74 BLOCK_B.4
BLKB-TX  (via drill 0.35)
  Top 0.254: G1.PC12 21.59,71.12 25.15,71.12 26.42,69.85 26.42,66.29 27.18,65.53 33.02,65.53 36.07,68.58 37.34,68.58 37.85,69.09 48.01,69.09 48.51,68.58 v48.51,65.53 | v54.86,65.28 72.88,65.28 75.3,67.69 | U2.4 77.83,67.44 77.45,67.06 74.66,67.06 75.3,67.69 | 75.3,67.69 U2.2 75.3,67.69
  Bottom 0.254: v48.51,65.53 54.61,65.53 v54.86,65.28
BLKB-TX+
  Top 0.254: BLOCK_B.1 94.69,22.05 95.25,22.61 95.25,65.02 92.46,67.82 88.9,67.82 86.11,70.61 86.11,74.17 84.33,75.95 R44.2
BLKB-TX-
  Top 0.254: 75.42,77.72 83.57,77.72 86.61,74.68 86.61,71.12 89.41,68.33 92.96,68.33 95.76,65.53 95.76,20.32 94.72,19.28 BLOCK_B.2
  Top 0.406: 75.42,77.72 75.5,77.72 R43.2
BLKC-DET  (via drill 0.35)
  Top 0.254: R11.2 R13.1 58.35,40.39 v54.86,40.39 | v34.54,52.58 46.23,52.58 46.74,53.09 47.5,53.09 47.75,52.83 47.75,40.89 v47.5,40.64
  Bottom 0.254: v34.54,52.58 34.29,52.32 25.65,52.32 24.13,50.8 21.59,50.8 G1.PA15 | v47.5,40.64 47.75,40.39 v54.86,40.39
BLKC-RX  (via drill 0.35)
  Top 0.254: R15.2 v64.77,40.32 R14.1 | G1.NC6-PB11 82.55,50.8 80.26,50.8 79.25,49.78 79.25,44.2 77.98,42.93 65.02,42.93 v64.77,43.18
  Bottom 0.254: v64.77,40.32 v64.77,43.18
BLKC-RX+
  Top 0.254: R12.2 86.87,22.42 86.87,45.21 88.19,46.53 BLOCK_C.5
BLKC-RX-
  Top 0.254: OK2.2 OK2.3 63.5,27.69 64.77,28.96 77.47,28.96 77.98,28.45 77.98,24.13 79.25,22.86 84.58,22.86 86.36,24.64 86.36,48.26 87.4,49.3 BLOCK_C.4
BLKC-TX  (via drill 0.35)
  Top 0.254: v73.91,48.01 73.91,48.51 71.63,50.8 53.59,50.8 52.83,51.56 52.83,65.02 53.85,66.04 65.02,66.04 | 65.02,66.04 66.41,67.42 U3.2 | 65.02,66.04 68.31,66.04 68.94,66.67 U3.4
  Bottom 0.254: v73.91,48.01 73.91,47.75 74.42,47.24 78.99,47.24 79.5,46.74 79.5,43.69 G1.PB10
BLKC-TX+  (via drill 0.35)
  Top 0.254: v96.52,57.4 96.27,57.66 96.27,66.04 93.47,68.83 89.92,68.83 87.12,71.63 87.12,75.18 83.57,78.74 69.83,78.74 68.83,77.74 R46.2
  Bottom 0.254: BLOCK_C.1 96.31,57.61 v96.52,57.4
BLKC-TX-  (via drill 0.35)
  Top 0.254: v97.03,54.61 97.28,54.86 97.28,57.91 96.77,58.42 96.77,66.55 93.98,69.34 90.42,69.34 87.63,72.14 87.63,75.69 84.07,79.25 67.31,79.25 66.29,78.23 R45.2
  Bottom 0.254: BLOCK_C.2 96.8,54.84 v97.03,54.61
BTNADC  (via drill 0.35)
  Top 0.254: R19.1 78.32,51.31 | 78.32,51.31 R18.1 R17.1 | R20.1 50.29,2.54 | 50.29,2.54 R25.1 | 50.16,6.35 50.16,2.67 50.29,2.54 | 50.16,6.35 50.16,10.16 | 50.16,10.16 50.16,12.06 50.55,12.45 v51.31,12.45 | R21.1 50.16,6.35 | R24.1 50.16,6.35 | R22.1 50.16,10.16 | R23.1 50.16,10.16 | G1.PB0 24.13,31.75 24.64,32.26 24.64,39.37 25.15,39.88 25.15,50.55 v25.65,51.05 | v46.74,52.07 45.97,52.07 45.62,51.71 v35.56,51.71 R16.2 | v54.1,50.04 71.12,50.04 v71.37,49.78 | v76.2,51.31 78.32,51.31 | v51.56,14.73 51.56,14.99 51.31,15.24 51.31,49.02 51.56,49.28 v51.56,52.83
  Bottom 0.254: v25.65,51.05 26.31,51.71 v35.56,51.71 | v54.1,50.04 52.07,52.07 51.56,52.07 | v71.37,49.78 72.9,49.78 74.42,51.31 v76.2,51.31 | v46.74,52.07 51.56,52.07 | v51.31,12.45 51.31,14.48 v51.56,14.73 | v51.56,52.83 51.56,52.07
GND  (via drill 0.35)
  Top 0.254: LED6.3 39.8,19.05 33.02,19.05 | 27.43,12.64 S4.2 | 27.43,12.64 27.43,17.53 28.96,19.05 33.02,19.05 | S4.2 24.13,12.46 24.13,16.84 LED4.3 | S5.2 31.51,12.7 | 27.43,12.64 27.49,12.7 31.51,12.7 | S6.2 39.13,12.7 31.51,12.7 | LED5.3 33.02,18.21 33.02,19.05 | 33.27,3.81 38.93,3.81 S6.1 42.36,0.38 53.49,0.38 S7.1 56.67,3.56 62.48,3.56 | 33.27,3.81 27.69,3.81 25.7,1.82 S4.1 S4.2 | S5.1 33.32,3.76 33.27,3.81 | S7.2 56.7,12.7 62.48,12.7 | 68.34,12.7 S9.2 | 62.48,12.7 68.34,12.7 | S8.2 62.48,10.94 62.48,12.7 | 62.48,3.56 68.39,3.56 S9.1 70.15,2.59 75.95,8.38 75.95,12.45 | S8.1 62.48,1.85 62.48,3.56 | 75.95,12.45 75.69,12.7 68.34,12.7 | 75.95,12.45 76.2,12.7 76.2,16 75.95,16.26 73.66,16.26 71.76,18.16 LED9.3 69.72,18.16 68.83,19.05 63.17,19.05 | 63.17,19.05 LED8.3 | LED7.3 54.7,18.2 | 54.7,18.2 55.55,19.05 63.17,19.05 | OK1.5 45.72,43.18 40.64,43.18 OK1.7 | v71.37,44.96 70.17,44.96 S3.1 69.6,45.53 69.6,46.48 69.09,46.99 64.26,46.99 | 64.26,46.99 62.53,45.26 S2.1 | 64.26,46.99 56.13,46.99 54.91,45.77 S1.1 54.93,44.96 v56.13,44.96 | S1.2 56.45,55.63 62.48,55.63 | 70.14,54.36 70.14,55.34 69.85,55.63 62.48,55.63 | 70.14,54.36 S3.2 | S2.2 62.52,55.59 62.48,55.63 | LED1.3 55.55,62.23 56.39,62.23 | LED2.3 62.28,61.92 61.98,62.23 | 56.39,62.23 61.98,62.23 | 61.98,62.23 69.01,62.23 LED3.3 70.99,61.34 v71.37,60.96 72.14,60.2 79.25,60.2 G1.GND7 82.55,60.96 84.84,60.96 85.09,60.71 85.09,50.8 G1.GND8 | v71.37,54.36 70.14,54.36 | v72.12,69.09 C1.1 | v44.45,66.8 44.38,66.74 R31.1 Q2.2 39.62,67.41 v39.62,67.82 | v56.39,61.47 56.39,62.23 | C2.1 36,70.61 v36.83,70.61 | U1.3 31.11,70.48 v30.99,70.61 | G1.GND6 25.15,62.48 v25.15,60.96
  Top 0.254: C3.1 48.26,17.29 49.48,18.5 49.48,20.01 v49.53,20.07 v49.53,35.56 | v52.58,20.07 53.34,19.3 53.34,19.2 54.34,18.2 54.7,18.2 | 67.67,69.72 67.67,69.96 v68.07,70.36 | v26.67,43.43 27.01,43.43 C10.2 | IC2.5 33.98,43.49 v34.04,43.43
  Top 0.406: C1.1 76.12,70.17 76.56,69.72 U2.3 | U3.3 67.67,69.72 | C2.1 31.82,70.17 31.11,69.47 U1.3
  Bottom 0.254: G1.AGND 82.55,35.56 77.47,35.56 OK2.9 74.93,33.02 71.12,33.02 | 71.12,33.02 66.04,33.02 | 66.04,33.02 62.23,33.02 OK2.15 60.96,33.78 60.2,33.02 57.91,33.02 57.15,33.78 57.15,34.54 56.13,35.56 v49.53,35.56 | 71.12,33.02 OK2.11 71.12,44.7 v71.37,44.96 71.37,45.97 70.1,47.24 70.1,53.09 v71.37,54.36 v71.37,60.96 72.37,61.96 72.37,69.34 v72.12,69.09 | OK2.13 66.04,33.02 | OK1.5 55.63,44.45 v56.13,44.96 | 35.56,46.23 34.54,47.24 23.11,47.24 G1.GND4 G1.GND5 G1.GND3 | v44.45,66.8 56.39,66.8 v56.39,61.47 | v36.83,70.61 v39.62,67.82 | v30.99,70.61 30.99,62.99 28.96,60.96 v25.15,60.96 21.84,60.96 21.59,61.21 21.59,63.5 G1.GND6 | v49.53,20.07 v52.58,20.07 | v27.18,47.24 26.67,46.74 v26.67,43.43 v34.04,43.43
  Bottom 0.813: JP1.5 17.78,76.2 23.62,76.2 24.64,75.18 24.64,65.79 23.62,64.77 G1.GND6
  other vias: 47.5,35.81 47.5,39.12 47.5,33.02 47.5,20.83 43.69,18.03 42.42,14.99 36.32,17.78 35.31,10.92 43.18,10.92 27.43,10.92 24.64,16.76 27.43,1.78 35.56,1.78 43.18,1.52 50.04,1.02 56.9,1.78 64.52,2.03 72.39,1.78 72.64,11.43 64.52,11.18 56.9,11.43 56.9,18.29 64.52,18.03 72.9,18.03 52.58,24.89 54.86,28.7 52.58,35.56 56.9,38.35 52.32,42.16 56.39,41.15 69.85,41.66 74.42,42.16 78.99,41.91 78.49,33.53 82.55,38.1 79.5,25.91 82.55,27.94 72.39,48.77 65.02,48.77 60.96,43.43 52.83,50.04 57.15,57.91 54.1,56.64 57.4,53.59 60.96,52.83 64.26,61.47 64.01,57.91 73.41,58.17 76.71,57.15 76.96,55.37 82.55,55.88 75.44,63.5 74.42,65.53 72.64,66.55 69.85,66.29 67.31,66.8 73.91,70.87 80.26,71.12 82.55,68.58 84.84,74.42 76.96,75.95 82.55,76.71 70.1,73.15 65.02,79.25 72.39,77.72 84.96,79.38 38.86,72.9 33.78,74.68 31.11,78.11 29.21,71.63 38.86,78.99 36.83,77.72 47.24,65.53 37.59,63.5 41.4,65.79 46.74,63.75 34.29,58.42 27.94,53.34 30.48,57.91 46.99,55.88 47.75,58.17 45.47,53.34 35.05,53.59 62.74,68.33 52.83,66.8 36.32,44.2 26.16,36.07 32.77,46.48 21.59,33.02 21.59,27.94 21.59,40.64 21.59,55.88 19.81,74.17 25.15,74.42 27.69,77.98 29.72,63.75 40.39,57.66
  pour Bottom: 19.05,79.76 19.05,25.4 23.88,25.4 23.88,30.23 25.4,31.75 25.4,35.31 27.18,35.31 27.18,42.42 34.54,42.42 36.32,40.64 45.47,40.64 46.99,39.12 46.99,20.07 46.74,19.81 23.88,19.81 23.88,0.25 76.45,0.25 76.45,19.81 53.59,19.81 53.59,26.67 57.4,30.48 78.23,30.48 78.99,29.72 78.99,25.4 79.25,25.15 85.09,25.15 85.34,25.4 85.34,79.76 64.01,79.76 64.01,71.63 39.62,71.63 39.62,79.76
  pour Top: 19.05,79.76 19.05,25.4 23.88,25.4 23.88,30.23 25.4,31.75 25.4,35.31 27.18,35.31 27.18,42.42 34.54,42.42 36.32,40.64 45.47,40.64 46.99,39.12 46.99,20.07 46.74,19.81 23.88,19.81 23.88,0.25 76.45,0.25 76.45,19.81 53.59,19.81 53.59,26.67 57.4,30.48 78.23,30.48 78.99,29.72 78.99,25.4 79.25,25.15 85.09,25.15 85.34,25.4 85.34,79.76 64.01,79.76 64.01,71.63 39.62,71.63 39.62,79.76
LED_DAT
  Top 0.254: G1.PA7 80.77,54.61 79.25,56.13 56.57,56.13 LED1.4
LN5V  (via drill 0.35)
  Top 0.254: Q4.3 38.71,32.34 38.45,32.61 | 38.45,32.61 R34.2 | 38.45,32.61 37.69,32.61 37.08,32 37.08,31.24 36.83,30.99 36,30.99 R38.2 35.49,30.8 34.04,32.26 v32.26,32.26 | v29.21,33.27 C9.2
  Top 0.406: IC2.1 29.59,34.67 C9.2 28.45,34.29 26.67,32.51 R37.1 26.1,31.43 24.89,30.23 24.89,25.3 24.41,24.82 21.84,24.82 20.25,23.23 C7.2
  Top 0.813: C7.2 20.25,19.97 IC3.1
  Bottom 0.254: v32.26,32.26 30.23,32.26 v29.21,33.27
LN-INT  (via drill 0.35)
  Top 0.254: G1.PC4 83.57,31.75 82.3,33.02 79.76,33.02 78.99,32.26 57.91,32.26 v55.63,34.54 | v48.01,34.54 48.26,34.8 48.26,56.13 47.5,56.9 v39.88,56.9 | v37.34,58.42 37,58.76 Q3.3
  Bottom 0.254: v55.63,34.54 v48.01,34.54 | v39.88,56.9 38.86,56.9 v37.34,58.42
LN-RX  (via drill 0.35)
  Top 0.254: G1.PA10 57.55,31.75 56.53,32.77 54.61,32.77 | 54.61,32.77 SJ1.1 | 54.61,32.77 54.61,32.98 54.1,33.48 v54.1,42.16 | v46.74,42.93 46.48,42.67 36.58,42.67 35.05,44.2 35.05,44.7 34.54,45.21 32.13,45.21 | R33.2 32.95,48.51 v30.99,48.51 30.99,46.48 32.13,45.34 32.13,45.21 | v30.99,50.42 30.99,51.82 32.08,52.91 D4.C | 32.13,45.21 IC2.6
  Bottom 0.254: v46.74,42.93 53.34,42.93 v54.1,42.16 | v30.99,48.51 v30.99,50.42
LN-RX-ALT
  Top 0.254: G1.PB14 85.09,38.1 85.09,30.73 84.84,30.48 80.26,30.48 79.5,31.24 57.15,31.24 56.13,30.23 54.61,30.23 SJ1.2
LN-RX-S  (via drill 0.35)
  Top 0.254: R35.1 34.61,23.43 33.53,22.35 23.62,22.35 v23.11,22.86 | R27.1 Q1.3 17.14,44.83 17.53,44.45 18.03,44.45 18.41,44.07 18.41,24.77 v18.54,24.64
  Bottom 0.254: v18.54,24.64 21.34,24.64 v23.11,22.86
LN-TX  (via drill 0.35)
  Top 0.254: v74.93,48.01 74.93,48.77 72.39,51.31 54.1,51.31 53.34,52.07 53.34,59.44 v53.85,59.94 | v47.75,59.94 47.5,59.94 46.74,60.71 44.52,60.71 R32.1 C5.2 Q3.2 | Q3.2 36.75,63.09 Q2.3 | Q3.2 33.97,60.64 31.5,58.17 31.5,53.34 29.97,51.82 v29.97,50.42 | R29.2 28.26,48.51 v29.97,48.51 29.97,46.23 30.86,45.34 IC2.7
  Bottom 0.254: G1.PA9 80.77,46.99 79.76,48.01 v74.93,48.01 | v53.85,59.94 v47.75,59.94 | v29.97,50.42 v29.97,48.51
LN-TX-B  (via drill 0.35)
  Top 0.254: R28.1 40.64,23.62 38.86,21.84 v22.86,21.84 | Q1.1 16.2,44.51 17.14,43.56 R30.1 16.44,42.86 16,42.42 16,39.62 16.51,39.12 16.76,39.12 17.91,37.97 17.91,25.4 17.79,25.29 17.79,24.12 v18.29,23.62
  Bottom 0.254: v22.86,21.84 22.35,22.35 22.35,22.86 21.59,23.62 v18.29,23.62
LN-TX-P  (via drill 0.35)
  Top 0.254: Q2.1 R31.2 43.25,64.52 v47.75,64.52 | G1.PC5 82.55,66.04 78.99,66.04 77.47,64.52 v53.85,64.52
  Bottom 0.254: v53.85,64.52 v47.75,64.52
LNPLUS  (via drill 0.35)
  Top 0.406: C6.2 29.61,31.24 29.61,29.32 IC1.5 28.99,29.25 v28.7,28.96 | C11.2 16.79,20.69 IC3.3 16.33,19.05 v16,19.05 14.99,20.07 14.99,26.92 14.99,27.18 14.99,31.24 12.57,33.66 D2.C
  Top 0.813: D2.C D1.C 6.49,30.99 2.79,30.99 2.29,31.5 2.29,65.84 4.77,68.33 12.45,68.33 JP1.2 JP1.4
  Bottom 0.406: v16,19.05 21.59,19.05 25.15,22.61 25.15,25.4 v28.7,28.96
N$1
  Top 0.254: R12.1 79.5,21.59 77.47,23.62 77.47,27.94 76.96,28.45 67.06,28.45 66.04,27.43 OK2.4 66.04,24.89 65.28,24.13 59.69,24.13 58.42,25.4 OK2.1
N$2
  Top 0.254: OK2.16 R13.2
N$3
  Top 0.254: OK2.14 63.5,35.31 66.04,37.85 R14.2
N$4
  Top 0.813: D1.A 3.55,34.16 3.55,43.93 | J4.6 5.35,45.74 3.55,43.93 | 3.55,43.93 3.55,59.68 6.12,62.25 J5.6
N$5
  Top 0.254: R26.1 C4.1 17.59,57.66 18.29,57.66 18.29,54.16 R27.2
N$6
  Top 0.813: J5.1 13.72,54.36 13.72,40.64 12.7,40.64 | 12.7,40.64 J4.1 | 12.7,40.64 12.7,37.08 13.97,35.81 15.24,35.81 16.52,34.53 D2.A
N$7
  Top 0.254: J5.3 11.69,59.19 15.68,63.18 R26.2
  Top 0.813: J5.3 10.41,59.19 9.39,60.21 J5.4 7.38,60.21 6.6,59.44 6.6,57.15 7.62,56.13 8.89,56.13 12.57,52.45 12.57,43.31 11.95,42.68 J4.3 10.15,42.68 9.13,43.7 J4.4
N$8
  Top 0.254: R34.1 39.54,30.8 Q4.1 40.2,30.8 40.64,31.24 41.91,31.24 42.42,31.75 42.42,33.02 41.91,33.53 40.13,33.53 39.62,34.04 35.81,34.04 34.8,35.05 34.8,40.13 34.54,40.39 31.5,40.39 30.86,39.75 IC2.2
N$9
  Top 0.254: R17.2 76.62,47.59 75.69,48.51 75.69,49.53 73.41,51.82 60.2,51.82 59.4,52.61 S1.4
N$10
  Top 0.254: R39.1 33.45,55.88 D4.A
N$11
  Top 0.254: R28.2 42.1,28.57 Q4.2
N$12
  Top 0.254: LED1.2 59.69,61.29 59.69,60.45 60.45,59.69 61.47,59.69 62.28,58.88 LED2.4
N$13
  Top 0.254: LED2.2 67.31,61.29 67.31,60.45 68.07,59.69 69.09,59.69 69.9,58.88 LED3.4
N$14  (via drill 0.35)
  Top 0.254: LED3.2 73.23,62.99 53.85,62.99 v53.59,62.74 | LED4.4 26.29,14.86 26.92,15.49 26.92,17.85 28.63,19.56 48.26,19.56 48.77,20.07 v48.77,62.74
  Bottom 0.254: v53.59,62.74 v48.77,62.74
N$15
  Top 0.254: LED4.2 33.07,15.52 LED5.4
N$16
  Top 0.254: LED5.2 40.69,15.52 LED6.4
N$17  (via drill 0.35)
  Top 0.254: LED6.2 48.13,18.16 v48.77,18.8 | v54.61,16 54.66,15.95 LED7.4
  Bottom 0.254: v54.61,16 54.61,16.76 52.58,18.8 v48.77,18.8
N$18
  Top 0.254: LED7.2 62.28,15.52 LED8.4
N$19
  Top 0.254: LED8.2 69.9,15.52 LED9.4
N$20
  Top 0.254: IC2.3 32.13,39.5 32.51,39.88 34.04,39.88 34.29,39.62 34.29,34.97 D3.A 34.56,33.96 R38.1
N$21
  Top 0.254: S4.4 32.96,8.13 44.96,8.13 45.72,7.37 45.72,5.08 47.41,3.39 R20.2
N$22
  Top 0.254: R32.2 C5.1 Q3.1 37.78,57.32 R39.2
N$23
  Top 0.254: S7.4 59.4,10.12 58.42,9.14 53.94,9.14 R23.2
N$24
  Top 0.254: R41.1 29.72,73.7 U1.7
N$25
  Top 0.254: R42.1 32.51,73.7 U1.5
N$26
  Top 0.254: R18.2 73.83,52.32 68.78,52.32 S2.4
N$27
  Top 0.254: S5.4 40.07,8.64 45.72,8.64 46.48,7.87 46.48,6.77 46.9,6.35 R21.2
N$28
  Top 0.254: S8.4 64.76,8.64 55.63,8.64 53.34,6.35 R24.2
N$29
  Top 0.254: R37.2 R40.1 26.95,26.63 IC1.1
N$30
  Top 0.254: C8.2 31.36,26.56 IC1.3 35.78,26.63 | R36.2 36.51,27.37 35.78,26.63 | 35.78,26.63 36.51,25.9 R35.2
N$31
  Top 0.254: R2.1 44.45,33.36 45.72,34.63 OK1.4 44.45,38.1 39.37,38.1 OK1.1
N$32
  Top 0.254: S3.4 75.88,54.08 R19.2
N$33
  Top 0.254: S6.4 45.43,9.69 45.97,9.14 46.99,9.14 47.41,9.56 R22.2
N$34
  Top 0.254: S9.4 71.87,8.13 56.13,8.13 53.85,5.84 53.85,3.47 R25.2
N$35
  Top 0.254: R7.1 82.3,17.78 76.2,23.88 OK2.8 76.2,27.43 75.69,27.94 69.85,27.94 OK2.5
N$36
  Top 0.254: R36.1 34.61,29.21 34.57,29.25 33.27,29.25 | IC1.4 33.27,29.25 | D3.C 33.27,29.25
N$37
  Top 0.406: R43.1 75.3,75.39 U2.7
N$38
  Top 0.254: R44.1 77.83,75.23 U2.5
N$39
  Top 0.254: R45.1 66.41,75.39 U3.7
N$40
  Top 0.254: R46.1 68.94,75.39 U3.5
N$41
  Top 0.254: OK1.8 R3.2
N$42
  Top 0.254: OK1.6 43.18,45.59 43.27,45.8 45.72,48.26 R4.2
N$43
  Top 0.254: OK2.12 R8.2
N$44
  Top 0.254: OK2.10 73.66,35.56 76.2,38.1 R9.2
VCC  (via drill 0.35)
  Top 0.203: 39.12,49.53 36.98,49.53 | 69.7,39.37 64.97,39.37 | 57.15,39.37 59.44,39.37
  Top 0.254: R5.1 R1.1 40.39,48.58 39.44,49.53 39.12,49.53 | 36.98,49.53 36.76,49.53 36.76,49.21 36.13,48.58 R16.1 34.73,48.58 34.29,49.02 34.29,49.78 33.78,50.29 33.21,50.29 R33.1 32.77,50.48 31.82,49.53 29.44,49.53 28.49,50.48 R29.1 27,50.48 26.81,50.29 | R10.1 R6.1 70.87,38.42 69.92,39.37 69.7,39.37 | 64.97,39.37 64.7,39.37 63.75,38.42 R15.1 R11.1 59.88,38.42 59.69,38.61 59.69,39.37 59.44,39.37 | 27.18,55.37 27.18,53.34 26.81,52.97 26.81,50.29 | 26.81,50.29 26.81,49.92 26.16,49.28 26.16,45.47 27.34,45.47 C10.1 28.87,45.55 29.59,44.83 IC2.8 | v50.29,61.98 50.04,61.72 50.04,51.82 50.29,51.56 50.29,50.8 49.28,49.78 49.28,39.37 v49.53,39.12 | v54.86,39.12 55.12,39.37 57.15,39.37
  Top 0.813: 27.18,55.37 v27.18,56.13 33.02,61.98 v35.31,61.98 | v39.12,62.48 v47.24,62.48
  Bottom 0.254: v47.24,62.48 47.75,61.98 v50.29,61.98 | v49.53,39.12 v54.86,39.12
  Bottom 0.813: G1.3V3 24.38,56.13 v27.18,56.13 | v35.31,61.98 38.61,61.98 v39.12,62.48

### Text on the board
tPlace: Block C | Anfangsf. | Erlaubnisf. | Endfeld | Block A | Block B | Endfeld | Erlaubnisf. | Anfangsf. | Anfangsf. | Erlaubnisf. | Endfeld
tNames: Nucleo-LN-Block3 | Rev. B4 | GN | LIN | SW | (c) Balazs Racz / 20240623
bNames: JP1: Power from LocoNet / 2+3: Nucleo linear regulator / 1+3: Switcher from LCC